# EAGLE design HomeAtion_RemoteDHT (EAGLE 7.5.0)
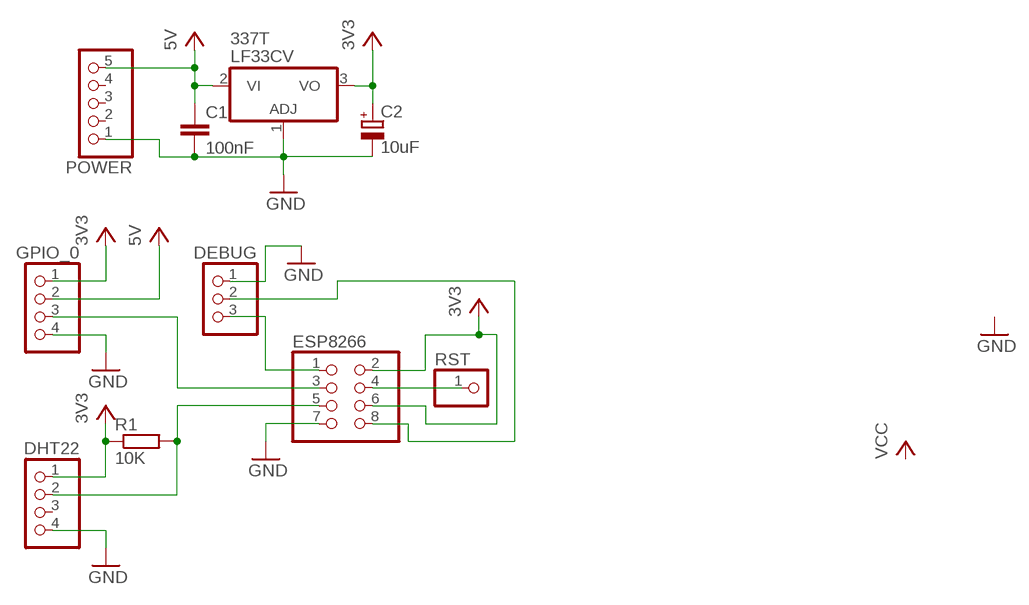
[diagram p0: schematic, sheet 1]

## Parts
C1  100nF  C2.5/5  [C2.5-5]
C2  10uF  CPOL-EUB45181A  [B45181A]
DEBUG  PINHD-1X3  [1X03]
DHT22  PINHD-1X4  [1X04]
ESP8266  PINHD-2X4  [2X04]
GPIO_0  PINHD-1X4  [1X04]
LF33CV  337T  [TO220H]
POWER  PINHD-1X5  [1X05]
R1  10K  R-EU_0204/7  [0204/7]
RST  PINHD-1X1  [1X01]

## Nets
GND: C1.2 C2.- DEBUG.1 DHT22.4 ESP8266.7 GPIO_0.4 LF33CV.1(ADJ) POWER.1
N$1: DEBUG.3 ESP8266.1
N$2: DEBUG.2 ESP8266.8
N$3: ESP8266.4 RST.1
N$5: DHT22.2 ESP8266.5 R1.2
N$7: ESP8266.3 GPIO_0.3
VCC: C1.1 C2.+ DHT22.1 ESP8266.2 ESP8266.6 GPIO_0.1 GPIO_0.2 LF33CV.2(VI) LF33CV.3(VO) POWER.5 R1.1 ; supply symbol labelled 5V, 3V3
Unconnected: DHT22.3 POWER.2 POWER.3 POWER.4

## Library data of the parts
C1 = capacitor-wima:C: CAPACITOR naming: grid - package width
C2 = rcl:CPOL-EU: POLARIZED CAPACITOR, European symbol
DEBUG = pinhead:PINHD-1X3: PIN HEADER
DHT22 GPIO_0 = pinhead:PINHD-1X4: PIN HEADER
ESP8266 = pinhead:PINHD-2X4: PIN HEADER
LF33CV = linear:*337: Negative VOLTAGE REGULATOR
POWER = pinhead:PINHD-1X5: PIN HEADER
R1 = rcl:R-EU_: RESISTOR, European symbol
RST = pinhead:PINHD-1X1: PIN HEADER

## Board
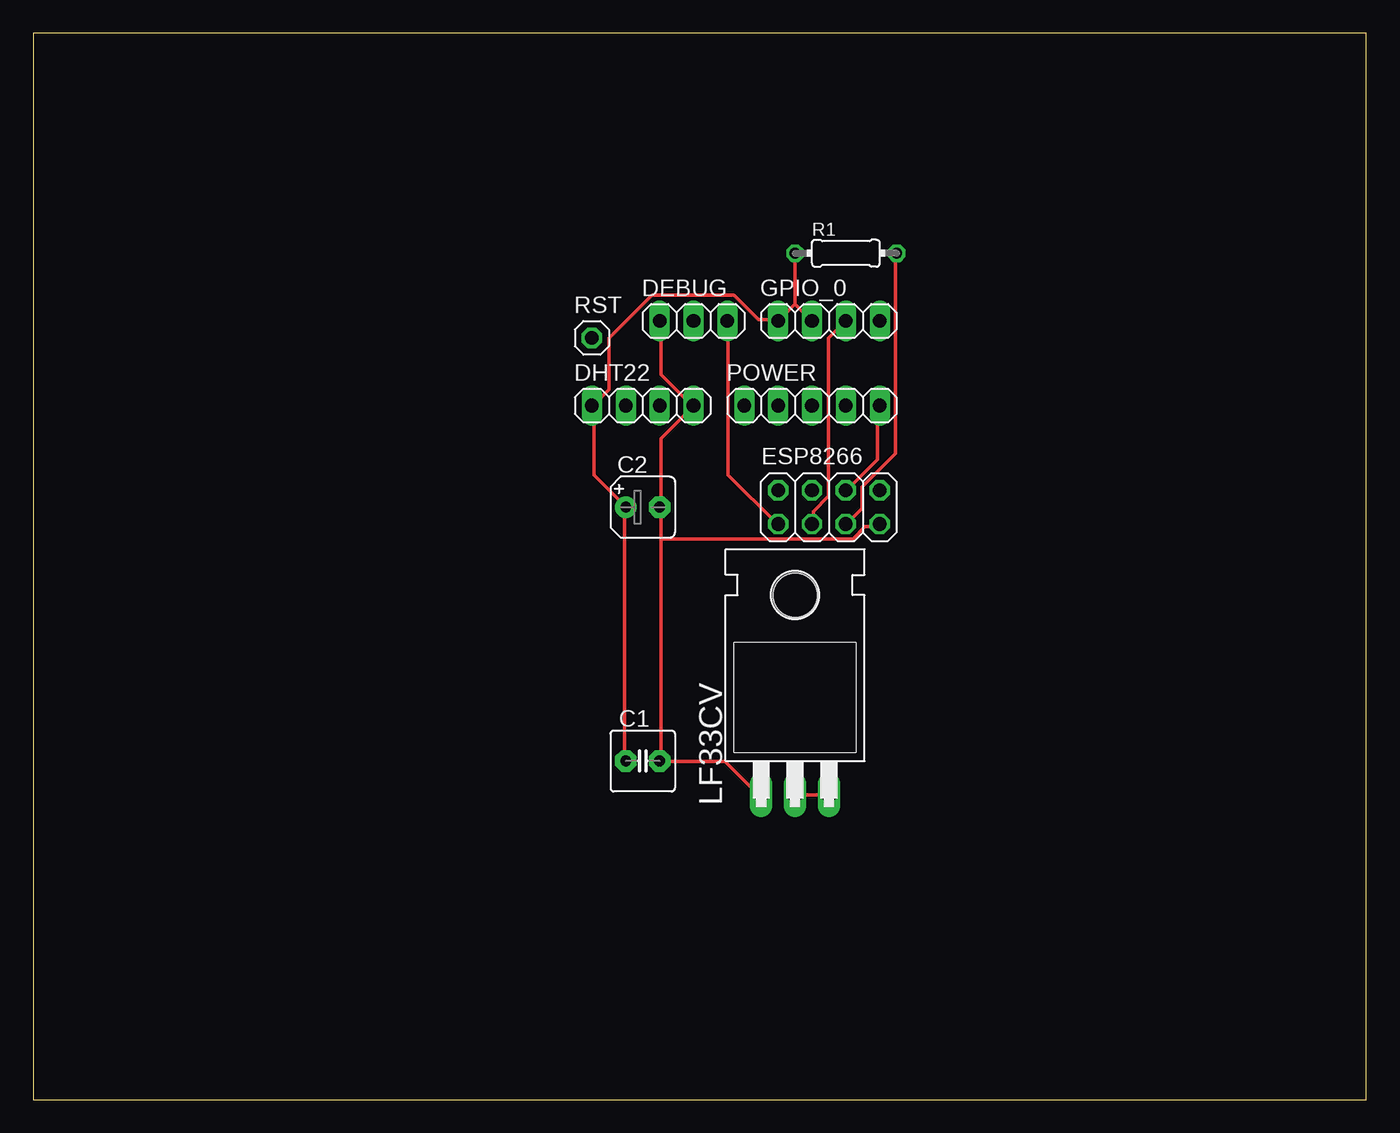
[diagram p1: board, top side]
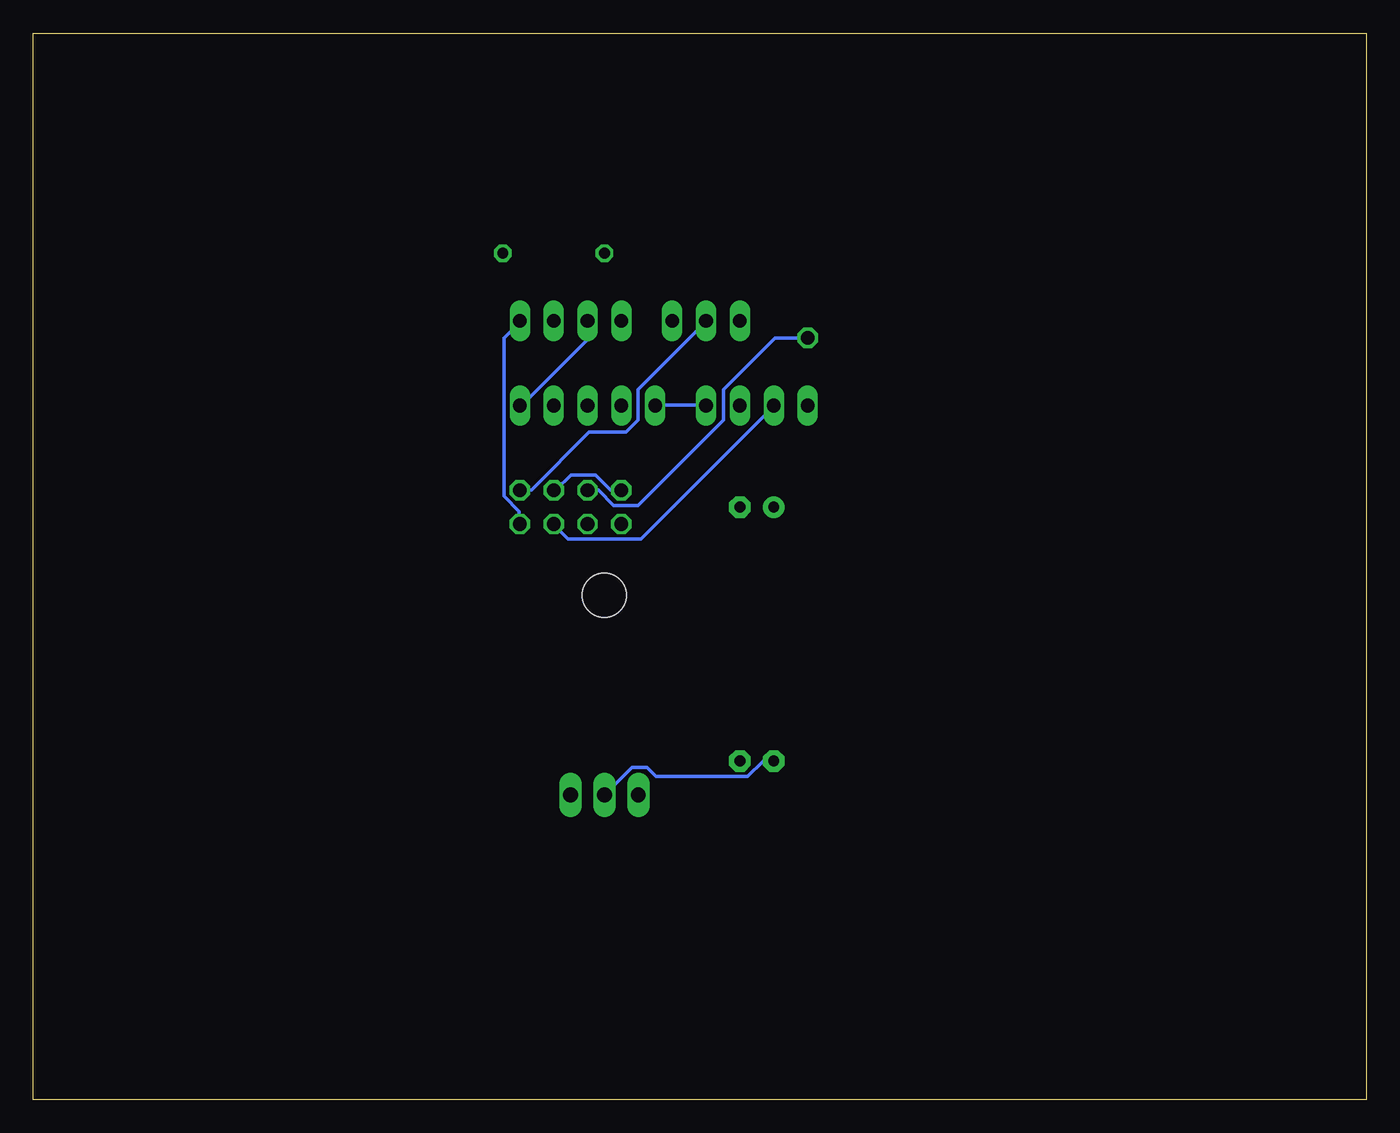
[diagram p2: board, bottom side, seen from below]

Size 100 x 80 mm. Coordinates in mm from the lower left corner, seen from the top.
Outline: 0,0 100,0 100,80 0,80 0,0
Copper layers (1*16): Top 0.035mm / dielectric 1.5mm / Bottom 0.035mm
Design rules "default": minimum track width 10mil, minimum drill 24mil, track to track 8mil, track to pad 8mil, pad to pad 8mil, via to via 8mil, smd to smd 8mil, copper to edge 40mil, drill to drill 8mil, minimum pad ring 10mil, minimum via ring 8mil, stop-mask expansion 4mil, vias tented up to drill 0mil, thermal gap 10mil

### Footprints (pad centres in the part's own frame; a part is rotated, then mirrored left to right if it is on the bottom)
C2.5-5 = drill 0.813 pad 1.6 octagon: 1 -1.27,0; 2 1.27,0
B45181A = drill 0.813 pad 1.6: + -1.27,0 | drill 0.813 pad 1.6 octagon: - 1.27,0
1X03 = drill 1.016 long: 1 -2.54,0; 2 0,0; 3 2.54,0
1X04 = drill 1.016 long: 1 -3.81,0; 2 -1.27,0; 3 1.27,0; 4 3.81,0
2X04 = drill 1.016 octagon: 1 -3.81,-1.27; 2 -3.81,1.27; 3 -1.27,-1.27; 4 -1.27,1.27; 5 1.27,-1.27; 6 1.27,1.27; 7 3.81,-1.27; 8 3.81,1.27
TO220H = drill 1.118 long: 1 -2.54,-10.16; 2 0,-10.16; 3 2.54,-10.16 | hole 3.302: 0,4.826
1X05 = drill 1.016 long: 1 -5.08,0; 2 -2.54,0; 3 0,0; 4 2.54,0; 5 5.08,0
0204/7 = drill 0.813 octagon: 1 -3.81,0; 2 3.81,0
1X01 = drill 1.016 octagon: 1 0,0

### Placement (x,y rotation side)
C1  45.72,25.4 0 top
C2  45.72,44.45 0 top
DEBUG  49.53,58.42 0 top
DHT22  45.72,52.07 0 top
ESP8266  59.69,44.45 0 top
GPIO_0  59.69,58.42 0 top
LF33CV  57.15,33.02 0 top
POWER  58.42,52.07 0 top
R1  60.96,63.5 0 top
RST  41.91,57.15 0 top

### Tracks (layer width: path | path; a pad name or v marks a point on that pad's centre or on a via)
GND
  Top 0.254: LF33CV.1 54.41,22.86 51.89,25.38 47.09,25.38 C1.2 47.09,25.6 47.09,42.06 | DEBUG.1 47.09,58.29 47.09,54.41 49.38,52.12 DHT22.4 49.38,51.89 47.09,49.61 47.09,44.58 C2.- 47.09,44.35 47.09,42.06 | 47.09,42.06 61.49,42.06 62.41,42.98 63.32,42.98 ESP8266.7
  Bottom 0.254: ESP8266.7 63.55,43.2 63.55,44.12 64.69,45.26 64.69,57.15 63.55,58.29 GPIO_0.4 | DHT22.4 49.61,52.12 53.26,52.12 POWER.1
N$1
  Top 0.254: DEBUG.3 52.12,58.29 52.12,46.86 55.78,43.2 ESP8266.1
N$2
  Bottom 0.254: ESP8266.8 62.64,45.72 58.29,50.06 55.55,50.06 54.63,50.98 54.63,53.26 49.61,58.29 DEBUG.2
N$3
  Bottom 0.254: ESP8266.4 57.61,45.72 56.46,44.58 54.63,44.58 48.23,50.98 48.23,53.26 44.35,57.15 RST.1
N$5
  Top 0.254: R1.2 64.69,63.32 64.69,48.46 62.18,45.95 62.18,44.35 61.04,43.2 ESP8266.5
  Bottom 0.254: DHT22.2 44.58,51.89 54.41,42.06 59.89,42.06 60.81,42.98 ESP8266.5
N$7
  Top 0.254: ESP8266.3 58.52,43.2 58.52,44.12 59.66,45.26 59.66,57.15 60.81,58.29 GPIO_0.3
VCC
  Top 0.254: 57.15,59.66 R1.1 | 57.15,59.66 56.01,58.52 GPIO_0.1 55.78,58.52 54.41,58.52 52.58,60.35 46.41,60.35 43.2,57.15 43.2,53.26 42.06,52.12 DHT22.1 42.06,51.89 42.06,46.86 44.35,44.58 C2.+ 44.35,44.35 44.35,25.6 C1.1 | 57.15,59.66 58.29,58.52 GPIO_0.2 | POWER.5 63.32,51.89 63.32,48.01 61.04,45.72 ESP8266.6 | LF33CV.2 LF33CV.3
  Bottom 0.254: ESP8266.2 56.69,45.72 57.84,46.86 59.66,46.86 60.81,45.72 ESP8266.6 | GPIO_0.2 58.52,58.29 58.52,56.92 63.32,52.12 POWER.5 | LF33CV.2 55.09,24.92 53.95,24.92 53.26,24.23 46.41,24.23 45.26,25.38 44.58,25.38 C1.1